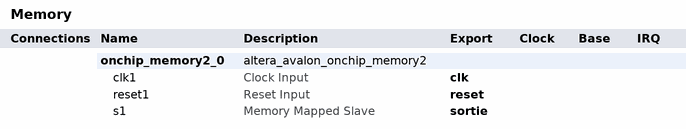
[diagram p0: system contents]
# Platform Designer (Qsys) system Memory, Cyclone IV E EP4CE115F29C8
# Parameters at their usual value, and those the tool derives, are not listed.
package require -exact qsys 15.1
create_system Memory
set_project_property DEVICE_FAMILY {Cyclone IV E}
set_project_property DEVICE EP4CE115F29C8

add_instance onchip_memory2_0 altera_avalon_onchip_memory2 15.1
set_instance_parameter_value onchip_memory2_0 dataWidth 16
set_instance_parameter_value onchip_memory2_0 dualPort false
set_instance_parameter_value onchip_memory2_0 initMemContent true
set_instance_parameter_value onchip_memory2_0 initializationFileName Memory.hex
set_instance_parameter_value onchip_memory2_0 memorySize 512
set_instance_parameter_value onchip_memory2_0 writable false

# exported interfaces
add_interface clk clock sink
set_interface_property clk EXPORT_OF onchip_memory2_0.clk1
add_interface reset reset sink
set_interface_property reset EXPORT_OF onchip_memory2_0.reset1
add_interface sortie avalon slave
set_interface_property sortie EXPORT_OF onchip_memory2_0.s1

set_interconnect_requirement {$system} qsys_mm.clockCrossingAdapter HANDSHAKE
set_interconnect_requirement {$system} qsys_mm.enableEccProtection FALSE
set_interconnect_requirement {$system} qsys_mm.insertDefaultSlave FALSE
set_interconnect_requirement {$system} qsys_mm.maxAdditionalLatency 1

save_system Memory.qsys
